# EasyEDA Pro project 16-bit-computer.eprj

# Schematic Schematic1
Create Date: 2024-07-05; Page Name: P1; Project Name: 16-bit-computer; Schematic Name: Schematic1; Update Date: 2024-07-05; Company: EasyEDA.com; Drawn: EasyEDA; Page Size: A4; Part Number: JLCPCB-002; Reviewed: EasyEDA; Version: V0.1
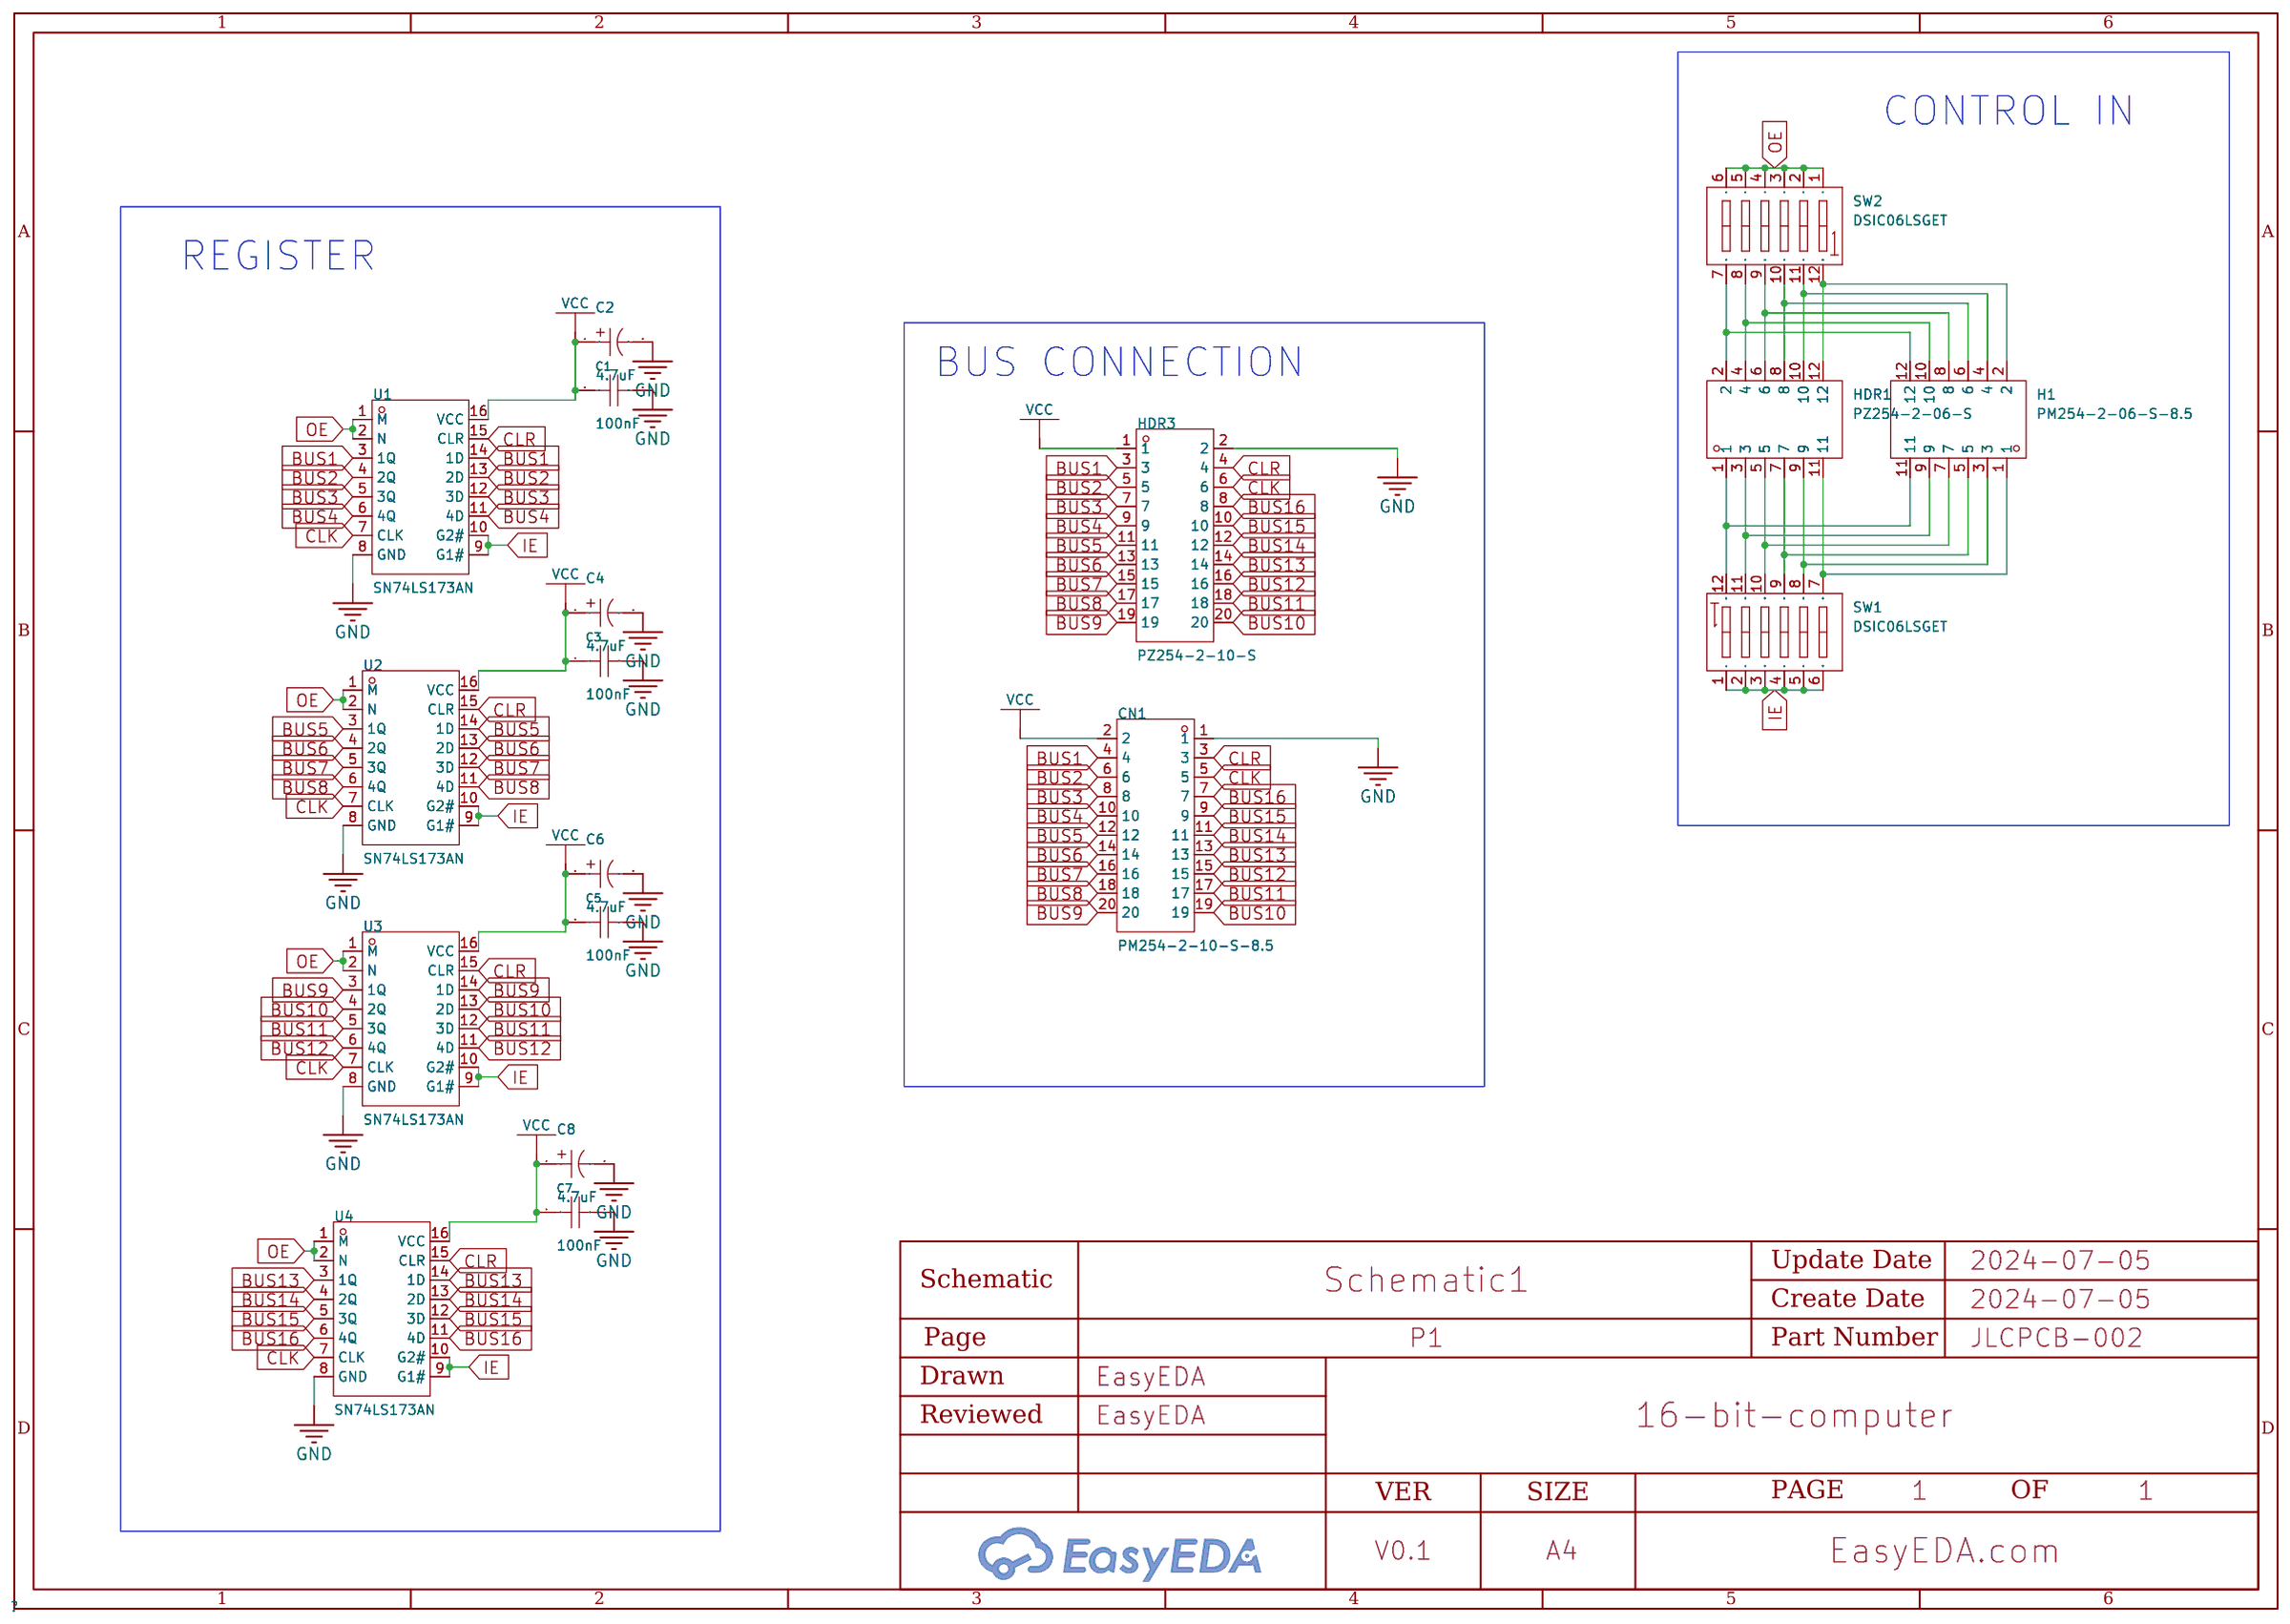
[diagram p0: schematic sheet]

## Parts
C1  100nF  [C0603]
C2  4.7uF  [CAP-SMD_BD4.0-L4.3-W4.3-LS5.0-FD]
C3  100nF  [C0603]
C4  4.7uF  [CAP-SMD_BD4.0-L4.3-W4.3-LS5.0-FD]
C5  100nF  [C0603]
C6  4.7uF  [CAP-SMD_BD4.0-L4.3-W4.3-LS5.0-FD]
C7  100nF  [C0603]
C8  4.7uF  [CAP-SMD_BD4.0-L4.3-W4.3-LS5.0-FD]
CN1  PM254-2-10-S-8.5  [HDR-SMD_20P-P2.54-V-F-R2-C10-S2.54-LS7.1]
H1  PM254-2-06-S-8.5  [HDR-SMD_12P-P2.54-V-F-R2-C6-S7.0]
HDR1  PZ254-2-06-S  [HDR-SMD_12P-P2.54-V-M-R2-C6-S7.4]
HDR3  PZ254-2-10-S  [HDR-SMD_20P-P2.54-V-M-R2-C10-S7.4]
SW1  DSIC06LSGET  [SW-SMD_12P-L15.2-W6.0-P2.54-LS9.3-BL]
SW2  DSIC06LSGET  [SW-SMD_12P-L15.2-W6.0-P2.54-LS9.3-BL]
U1  SN74LS173AN  [PDIP-16_L19.3-W6.4-P2.54-LS7.94-BL]
U2  SN74LS173AN  [PDIP-16_L19.3-W6.4-P2.54-LS7.94-BL]
U3  SN74LS173AN  [PDIP-16_L19.3-W6.4-P2.54-LS7.94-BL]
U4  SN74LS173AN  [PDIP-16_L19.3-W6.4-P2.54-LS7.94-BL]

## Library data of the parts
C1 C3 C5 C7 = CL10B104KB8NNNC: Capacitance: Tolerance:±10% Tolerance:±10% Voltage Rated: Temperature Coefficient:; LCSC Part Name: 100nF ±10% 50V; Supplier Part: C1591; Manufacturer: SAMSUNG(三星); Supplier Footprint: 0603; JLCPCB Part Class: Extended Part; Datasheet: https://atta.szlcsc.com/upload/public/pdf/source/20160218/1457707763339.pdf; Supplier: LCSC; Tolerance: ±10%
C2 C4 C6 C8 = VT4.7UF50V167RV0133: Capacitance: Tolerance:±20% Tolerance:±20% Rated Voltage: Ripple Current:15mA@120Hz Equivalent Series Resistance(ESR):- φD: L: Lifetime @ Temp:2000hrs@105℃ Operating Temperature:-55℃~+105℃ Operating Temperature:-55℃~+105℃; LCSC Part Name: 4.7uF ±20% 50V; Supplier Part: C5246584; Manufacturer: KNSCHA(科尼盛); Supplier Footprint: SMD,D4xL5.4mm; JLCPCB Part Class: Extended Part; Datasheet: https://atta.szlcsc.com/upload/public/pdf/source/20221104/28D100275C90741A69E4DC1F6F9A3749.pdf; Supplier: LCSC; Tolerance: ±20%; Ripple Current: 15mA@120Hz; Lifetime @ Temp: 2000hrs@105℃; Operating Temperature: -55℃~+105℃
CN1 = PM254-2-10-S-8.5: Holes Structure:2x10P Pitch:2.54mm Row Spacing:2.54mm Circular Hole / Square Hole:方孔 Mounting Type:Brick nogging Number of Rows:双排 Number of Holes:20P Current Rating (Max):3A Holes Direction:Top Insulation Height:8.5mm Contact Material:Copper Alloy Operat; LCSC Part Name: 2x10P 间距:2.54mm 立贴; Supplier Part: C3975155; Manufacturer: HCTL(华灿天禄); Supplier Footprint: SMD,P=2.54mm; JLCPCB Part Class: Extended Part; Datasheet: https://atta.szlcsc.com/upload/public/pdf/source/20230609/7C6F8D8E301C6BBC8F19D55951C36597.pdf; Supplier: LCSC; Holes Structure: 2x10P; Pitch: 2.54mm; Row Spacing: 2.54mm; Circular Hole / Square Hole: 方孔; Mounting Type: Brick nogging; Number of Rows: 双排; Number of Holes: 20P; Current Rating (Max): 3A; Holes Direction: Top; Insulation Height: 8.5mm; Contact Material: Copper Alloy; Operating Temperature Range: -40℃~+105℃; Soldering Temperature(Max): 260℃@5S
H1 = PM254-2-06-S-8.5: Holes Structure:2x6P Pitch:2.54mm Row Spacing:2.54mm Circular Hole / Square Hole:方孔 Mounting Type:Brick nogging Number of Rows:双排 Number of Holes:12P Current Rating (Max):3A Holes Direction:Top Insulation Height:8.5mm Contact Material:Copper Alloy Operati; LCSC Part Name: 2x6P 间距:2.54mm 立贴; Supplier Part: C3975151; Manufacturer: HCTL(华灿天禄); Supplier Footprint: SMD,P=2.54mm; JLCPCB Part Class: Extended Part; Datasheet: https://atta.szlcsc.com/upload/public/pdf/source/20230609/7C6F8D8E301C6BBC8F19D55951C36597.pdf; Supplier: LCSC; Holes Structure: 2x6P; Pitch: 2.54mm; Row Spacing: 2.54mm; Circular Hole / Square Hole: 方孔; Mounting Type: Brick nogging; Number of Rows: 双排; Number of Holes: 12P; Current Rating (Max): 3A; Holes Direction: Top; Insulation Height: 8.5mm; Contact Material: Copper Alloy; Operating Temperature Range: -40℃~+105℃; Soldering Temperature(Max): 260℃@5S
HDR1 = PZ254-2-06-S: Pin Structure:2x6P Pitch:2.54mm Row Spacing:2.54mm Circluar Pins/Square Pins:Square Pins Mounting Type:Brick nogging Number of Rows:双排 Number of Pins:12P Current Rating (Max):3A Voltage Rating (Max):250V Length of Mating Pin:6mm Insulation Height:2.5mm Le; LCSC Part Name: 2x6P 间距:2.54mm 方针 立贴 黑色; Supplier Part: C3294464; Manufacturer: HCTL(华灿天禄); Supplier Footprint: SMD,P=2.54mm; JLCPCB Part Class: Extended Part; Datasheet: https://atta.szlcsc.com/upload/public/pdf/source/20230609/FB2B5B924AA338E6CB93C3BD1D012B72.pdf; Supplier: LCSC; Pin Structure: 2x6P; Pitch: 2.54mm; Row Spacing: 2.54mm; Circluar Pins/Square Pins: Square Pins; Mounting Type: Brick nogging; Number of Rows: 双排; Number of Pins: 12P; Current Rating (Max): 3A; Voltage Rating (Max): 250V; Length of Mating Pin: 6mm; Insulation Height: 2.5mm; Operating Temperature Range: -40℃~+105℃; Soldering Temperature(Max): 260℃@5S; Color: Black
HDR3 = PZ254-2-10-S: Pin Structure:2x10P Pitch:2.54mm Row Spacing:2.54mm Circluar Pins/Square Pins:Square Pins Mounting Type:Brick nogging Number of Rows:双排 Number of Pins:20P Current Rating (Max):3A Voltage Rating (Max):250V Length of Mating Pin:6mm Insulation Height:2.5mm L; LCSC Part Name: 2x10P 间距:2.54mm 方针 立贴 黑色; Supplier Part: C3294468; Manufacturer: HCTL(华灿天禄); Supplier Footprint: SMD,P=2.54mm; JLCPCB Part Class: Extended Part; Datasheet: https://atta.szlcsc.com/upload/public/pdf/source/20230609/FB2B5B924AA338E6CB93C3BD1D012B72.pdf; Supplier: LCSC; Pin Structure: 2x10P; Pitch: 2.54mm; Row Spacing: 2.54mm; Circluar Pins/Square Pins: Square Pins; Mounting Type: Brick nogging; Number of Rows: 双排; Number of Pins: 20P; Current Rating (Max): 3A; Voltage Rating (Max): 250V; Length of Mating Pin: 6mm; Insulation Height: 2.5mm; Operating Temperature Range: -40℃~+105℃; Soldering Temperature(Max): 260℃@5S; Color: Black
SW1 SW2 = DSIC06LSGET: Type:平拨,凸起式 Circuit:SPST Number of Positions:6Bit Lead Pitch:2.54mm Operating Life:- Color:Black; LCSC Part Name: 2.54mm 6位高推 拨码开关; Supplier Part: C54952; Manufacturer: YE; Supplier Footprint: SMD-12P,6x15.2mm; JLCPCB Part Class: Extended Part; Datasheet: https://atta.szlcsc.com/upload/public/pdf/source/20150928/1457707425586.pdf; Supplier: LCSC; Type: 平拨,凸起式; Circuit: SPST; Number of Positions: 6Bit; Lead Pitch: 2.54mm; Color: Black
U1-U4 = SN74LS173AN: Type:D-Type Trigger Type:上升沿 Supply Voltage:4.75V~5.25V Supply Voltage:4.75V~5.25V Clock Frequency:50MHz Function:Reset Number of Elements:1 Number of Bits per Element:4 Output Type: Maximum Propagation Delay:30ns@5V,45pF Series:74LSSeries Sink Current:24; Supplier Part: C1550125; Manufacturer: TI(德州仪器); Supplier Footprint: PDIP-16; JLCPCB Part Class: Extended Part; Datasheet: https://www.ti.com/cn/lit/gpn/sn54ls173a; Supplier: LCSC; Type: D-Type; Trigger Type: 上升沿; Supply Voltage: 4.75V~5.25V; Clock Frequency: 50MHz; Function: Reset; Number of Elements: 1; Number of Bits per Element: 4; Maximum Propagation Delay: 30ns@5V,45pF; Series: 74LSSeries; Sink Current: 24mA; Source Current: 2.6mA; Quiescent Current (Iq): 24mA; Operating Temperature: 0℃~+70℃

## Nets
GND: C1.2 C2.2 C3.2 C4.2 C5.2 C6.2 C7.2 C8.2 CN1.1 HDR3.2 U1.8(GND) U2.8(GND) U3.8(GND) U4.8(GND)
VCC: C1.1 C2.1 C3.1 C4.1 C5.1 C6.1 C7.1 C8.1 CN1.2 HDR3.1 U1.16(VCC) U2.16(VCC) U3.16(VCC) U4.16(VCC)
BUS1: CN1.4 HDR3.3 U1.3(1Q) U1.14(1D)
BUS2: CN1.6 HDR3.5 U1.4(2Q) U1.13(2D)
BUS3: CN1.8 HDR3.7 U1.5(3Q) U1.12(3D)
BUS4: CN1.10 HDR3.9 U1.6(4Q) U1.11(4D)
BUS5: CN1.12 HDR3.11 U2.3(1Q) U2.14(1D)
BUS6: CN1.14 HDR3.13 U2.4(2Q) U2.13(2D)
BUS7: CN1.16 HDR3.15 U2.5(3Q) U2.12(3D)
BUS8: CN1.18 HDR3.17 U2.6(4Q) U2.11(4D)
BUS9: CN1.20 HDR3.19 U3.3(1Q) U3.14(1D)
BUS10: CN1.19 HDR3.20 U3.4(2Q) U3.13(2D)
BUS11: CN1.17 HDR3.18 U3.5(3Q) U3.12(3D)
BUS12: CN1.15 HDR3.16 U3.6(4Q) U3.11(4D)
BUS13: CN1.13 HDR3.14 U4.3(1Q) U4.14(1D)
BUS14: CN1.11 HDR3.12 U4.4(2Q) U4.13(2D)
BUS15: CN1.9 HDR3.10 U4.5(3Q) U4.12(3D)
BUS16: CN1.7 HDR3.8 U4.6(4Q) U4.11(4D)
CLK: CN1.5 HDR3.6 U1.7(CLK) U2.7(CLK) U3.7(CLK) U4.7(CLK)
CLR: CN1.3 HDR3.4 U1.15(CLR) U2.15(CLR) U3.15(CLR) U4.15(CLR)
IE: SW1.1(A1) SW1.2(A2) SW1.3(A3) SW1.4(A4) SW1.5(A5) SW1.6(A6) U1.9(G1#) U1.10(G2#) U2.9(G1#) U2.10(G2#) U3.9(G1#) U3.10(G2#) U4.9(G1#) U4.10(G2#)
OE: SW2.1(A1) SW2.2(A2) SW2.3(A3) SW2.4(A4) SW2.5(A5) SW2.6(A6) U1.1(M) U1.2(N) U2.1(M) U2.2(N) U3.1(M) U3.2(N) U4.1(M) U4.2(N)
$1N4246: H1.2 HDR1.12 SW2.12(B1)
$1N4255: H1.4 HDR1.10 SW2.11(B2)
$1N4264: H1.6 HDR1.8 SW2.10(B3)
$1N4273: H1.8 HDR1.6 SW2.9(B4)
$1N4286: H1.10 HDR1.4 SW2.8(B5)
$1N4295: H1.12 HDR1.2 SW2.7(B6)
$1N4304: H1.1 HDR1.11 SW1.7(B6)
$1N4309: H1.3 HDR1.9 SW1.8(B5)
$1N4318: H1.5 HDR1.7 SW1.9(B4)
$1N4327: H1.7 HDR1.5 SW1.10(B3)
$1N4336: H1.9 HDR1.3 SW1.11(B2)
$1N4345: H1.11 HDR1.1 SW1.12(B1)

## Notes on the sheet
- CONTROL IN
- REGISTER
- BUS CONNECTION

# Schematic Schematic2
Create Date: 2024-07-05; Page Name: P1; Project Name: 16-bit-computer; Schematic Name: Schematic2; Update Date: 2024-07-05; Company: EasyEDA.com; Drawn: EasyEDA; Page Size: A4; Part Number: JLCPCB-002; Reviewed: EasyEDA; Version: V0.1
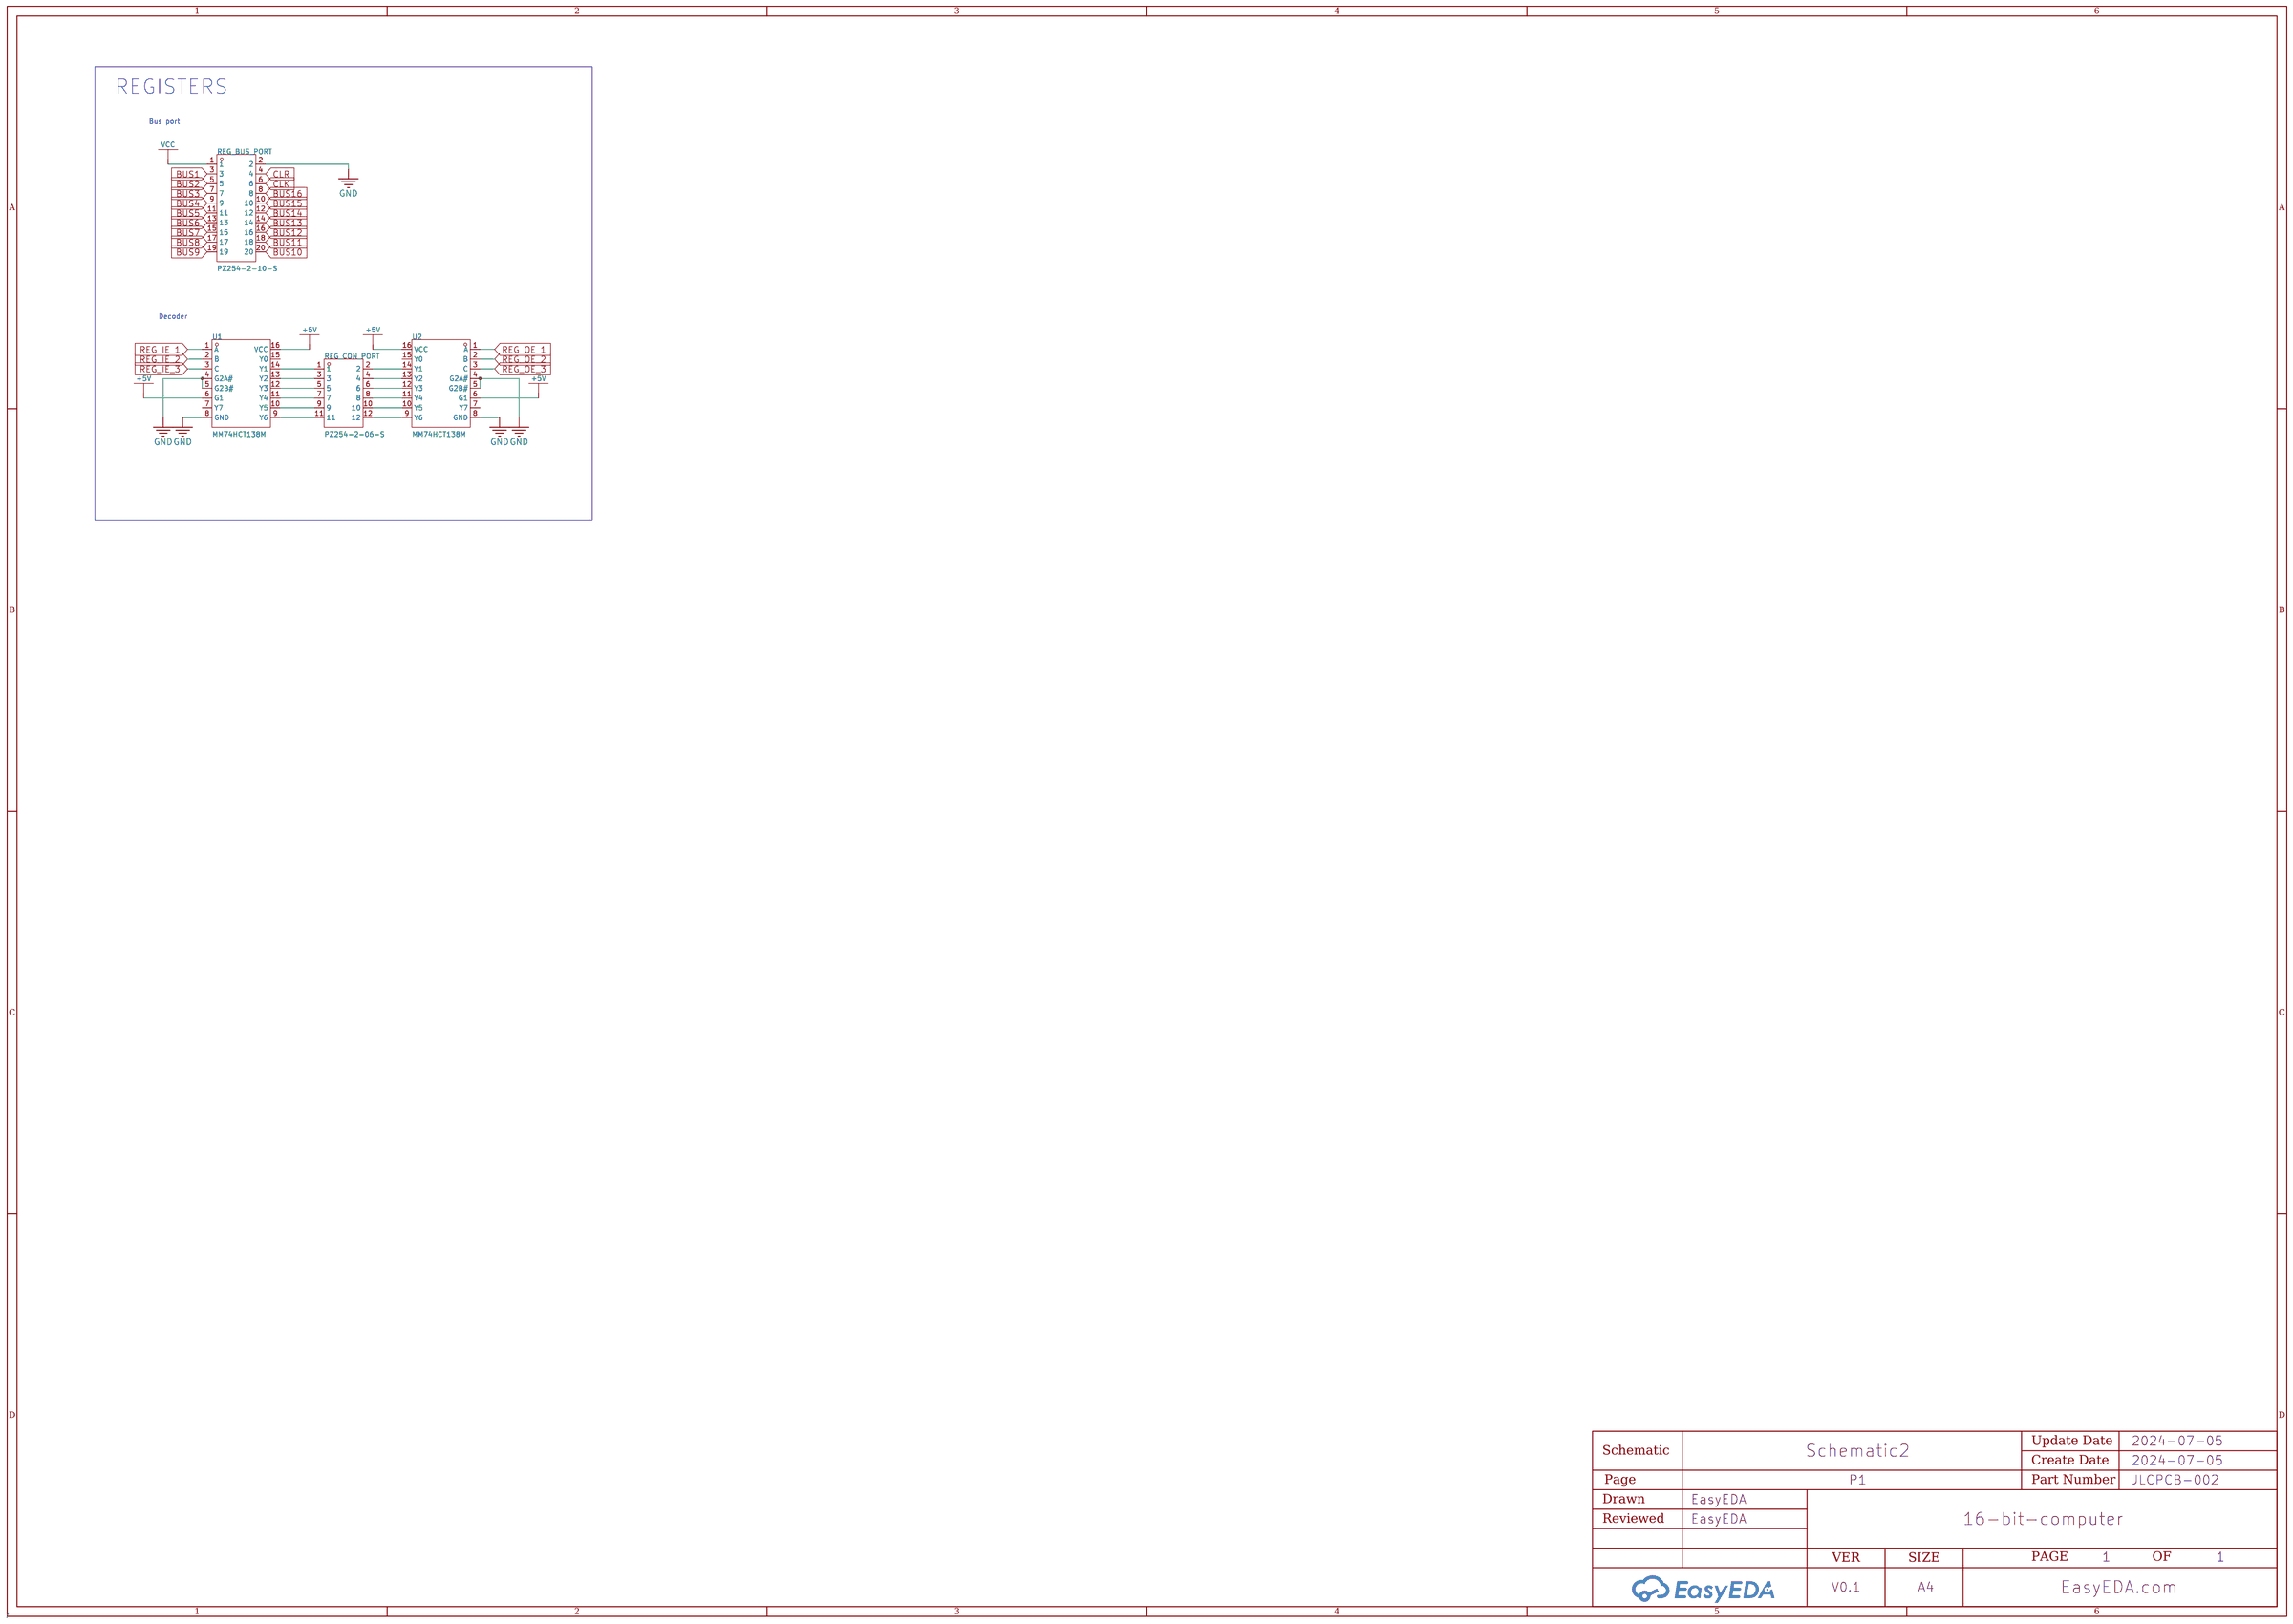
[diagram p1: schematic sheet]

## Parts
REG_BUS_PORT  PZ254-2-10-S  [HDR-SMD_20P-P2.54-V-M-R2-C10-S7.4]
REG_CON_PORT  PZ254-2-06-S  [HDR-SMD_12P-P2.54-V-M-R2-C6-S7.4]
U1  MM74HCT138M  [SOIC-16_L9.9-W3.9-P1.27-LS6.0-BL]
U2  MM74HCT138M  [SOIC-16_L9.9-W3.9-P1.27-LS6.0-BL]

## Library data of the parts
REG_BUS_PORT = PZ254-2-10-S: Pin Structure:2x10P Pitch:2.54mm Row Spacing:2.54mm Circluar Pins/Square Pins:Square Pins Mounting Type:Brick nogging Number of Rows:双排 Number of Pins:20P Current Rating (Max):3A Voltage Rating (Max):250V Length of Mating Pin:6mm Insulation Height:2.5mm L; LCSC Part Name: 2x10P 间距:2.54mm 方针 立贴 黑色; Supplier Part: C3294468; Manufacturer: HCTL(华灿天禄); Supplier Footprint: SMD,P=2.54mm; JLCPCB Part Class: Extended Part; Datasheet: https://atta.szlcsc.com/upload/public/pdf/source/20230609/FB2B5B924AA338E6CB93C3BD1D012B72.pdf; Supplier: LCSC; Pin Structure: 2x10P; Pitch: 2.54mm; Row Spacing: 2.54mm; Circluar Pins/Square Pins: Square Pins; Mounting Type: Brick nogging; Number of Rows: 双排; Number of Pins: 20P; Current Rating (Max): 3A; Voltage Rating (Max): 250V; Length of Mating Pin: 6mm; Insulation Height: 2.5mm; Operating Temperature Range: -40℃~+105℃; Soldering Temperature(Max): 260℃@5S; Color: Black
REG_CON_PORT = PZ254-2-06-S: Pin Structure:2x6P Pitch:2.54mm Row Spacing:2.54mm Circluar Pins/Square Pins:Square Pins Mounting Type:Brick nogging Number of Rows:双排 Number of Pins:12P Current Rating (Max):3A Voltage Rating (Max):250V Length of Mating Pin:6mm Insulation Height:2.5mm Le; LCSC Part Name: 2x6P 间距:2.54mm 方针 立贴 黑色; Supplier Part: C3294464; Manufacturer: HCTL(华灿天禄); Supplier Footprint: SMD,P=2.54mm; JLCPCB Part Class: Extended Part; Datasheet: https://atta.szlcsc.com/upload/public/pdf/source/20230609/FB2B5B924AA338E6CB93C3BD1D012B72.pdf; Supplier: LCSC; Pin Structure: 2x6P; Pitch: 2.54mm; Row Spacing: 2.54mm; Circluar Pins/Square Pins: Square Pins; Mounting Type: Brick nogging; Number of Rows: 双排; Number of Pins: 12P; Current Rating (Max): 3A; Voltage Rating (Max): 250V; Length of Mating Pin: 6mm; Insulation Height: 2.5mm; Operating Temperature Range: -40℃~+105℃; Soldering Temperature(Max): 260℃@5S; Color: Black
U1 U2 = MM74HCT138M: Type:Decoder/Demultiplexers Voltage Supply Source:Single supply Supply Voltage:4.5V~5.5V Supply Voltage:4.5V~5.5V Sink Current:4.8mA Source Current:4.8mA Operating temperature:-40℃~+85℃ Operating temperature:-40℃~+85℃; Supplier Part: C906893; Manufacturer: onsemi(安森美); Supplier Footprint: SOIC-16; JLCPCB Part Class: Extended Part; Datasheet: https://atta.szlcsc.com/upload/public/pdf/source/20210720/C906893_1BC560CB53C63A6B39486B89408AFB3E.pdf; Supplier: LCSC; Type: Decoder/Demultiplexers; Voltage Supply Source: Single supply; Supply Voltage: 4.5V~5.5V; Sink Current: 4.8mA; Source Current: 4.8mA; Operating temperature: -40℃~+85℃

## Nets
+5V: U1.6(G1) U1.16(VCC) U2.6(G1) U2.16(VCC)
GND: REG_BUS_PORT.2 U1.4(G2A#) U1.5(G2B#) U1.8(GND) U2.4(G2A#) U2.5(G2B#) U2.8(GND)
VCC: REG_BUS_PORT.1
BUS1: REG_BUS_PORT.3
BUS2: REG_BUS_PORT.5
BUS3: REG_BUS_PORT.7
BUS4: REG_BUS_PORT.9
BUS5: REG_BUS_PORT.11
BUS6: REG_BUS_PORT.13
BUS7: REG_BUS_PORT.15
BUS8: REG_BUS_PORT.17
BUS9: REG_BUS_PORT.19
BUS10: REG_BUS_PORT.20
BUS11: REG_BUS_PORT.18
BUS12: REG_BUS_PORT.16
BUS13: REG_BUS_PORT.14
BUS14: REG_BUS_PORT.12
BUS15: REG_BUS_PORT.10
BUS16: REG_BUS_PORT.8
CLK: REG_BUS_PORT.6
CLR: REG_BUS_PORT.4
REG_IE_1: U1.1(A)
REG_IE_2: U1.2(B)
REG_IE_3: U1.3(C)
REG_OE_1: U2.1(A)
REG_OE_2: U2.2(B)
REG_OE_3: U2.3(C)
Net-(REG_CON_PORT-1): REG_CON_PORT.1 U1.14(Y1)
Net-(REG_CON_PORT-2): REG_CON_PORT.2 U2.14(Y1)
Net-(REG_CON_PORT-3): REG_CON_PORT.3 U1.13(Y2)
Net-(REG_CON_PORT-4): REG_CON_PORT.4 U2.13(Y2)
Net-(REG_CON_PORT-5): REG_CON_PORT.5 U1.12(Y3)
Net-(REG_CON_PORT-6): REG_CON_PORT.6 U2.12(Y3)
Net-(REG_CON_PORT-7): REG_CON_PORT.7 U1.11(Y4)
Net-(REG_CON_PORT-8): REG_CON_PORT.8 U2.11(Y4)
Net-(REG_CON_PORT-9): REG_CON_PORT.9 U1.10(Y5)
Net-(REG_CON_PORT-10): REG_CON_PORT.10 U2.10(Y5)
Net-(REG_CON_PORT-11): REG_CON_PORT.11 U1.9(Y6)
Net-(REG_CON_PORT-12): REG_CON_PORT.12 U2.9(Y6)

Not connected (* = marked no-connect by the designer): U1 7(Y7) 15(Y0); U2 7(Y7) 15(Y0)

## Notes on the sheet
- REGISTERS
- Bus port
- Decoder

# Board PCB1
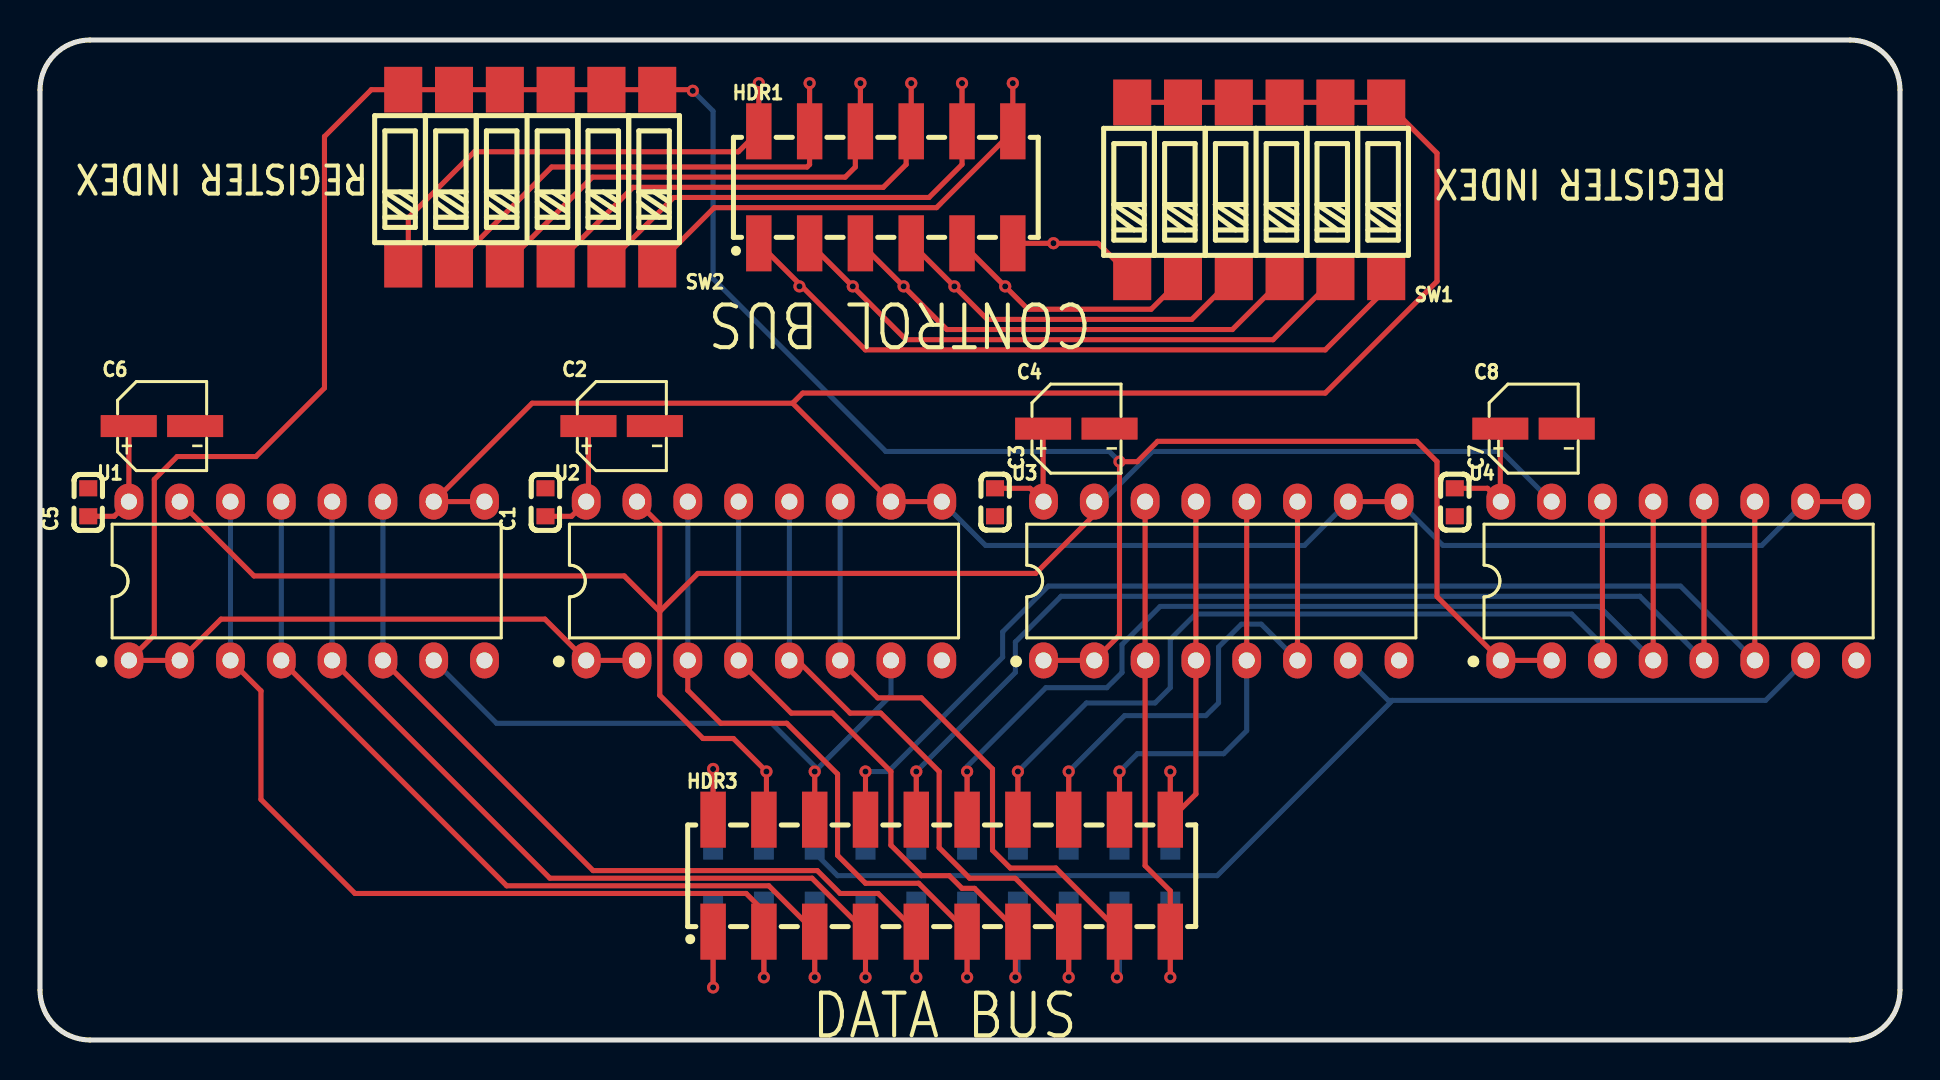
[diagram p2: board, top side]
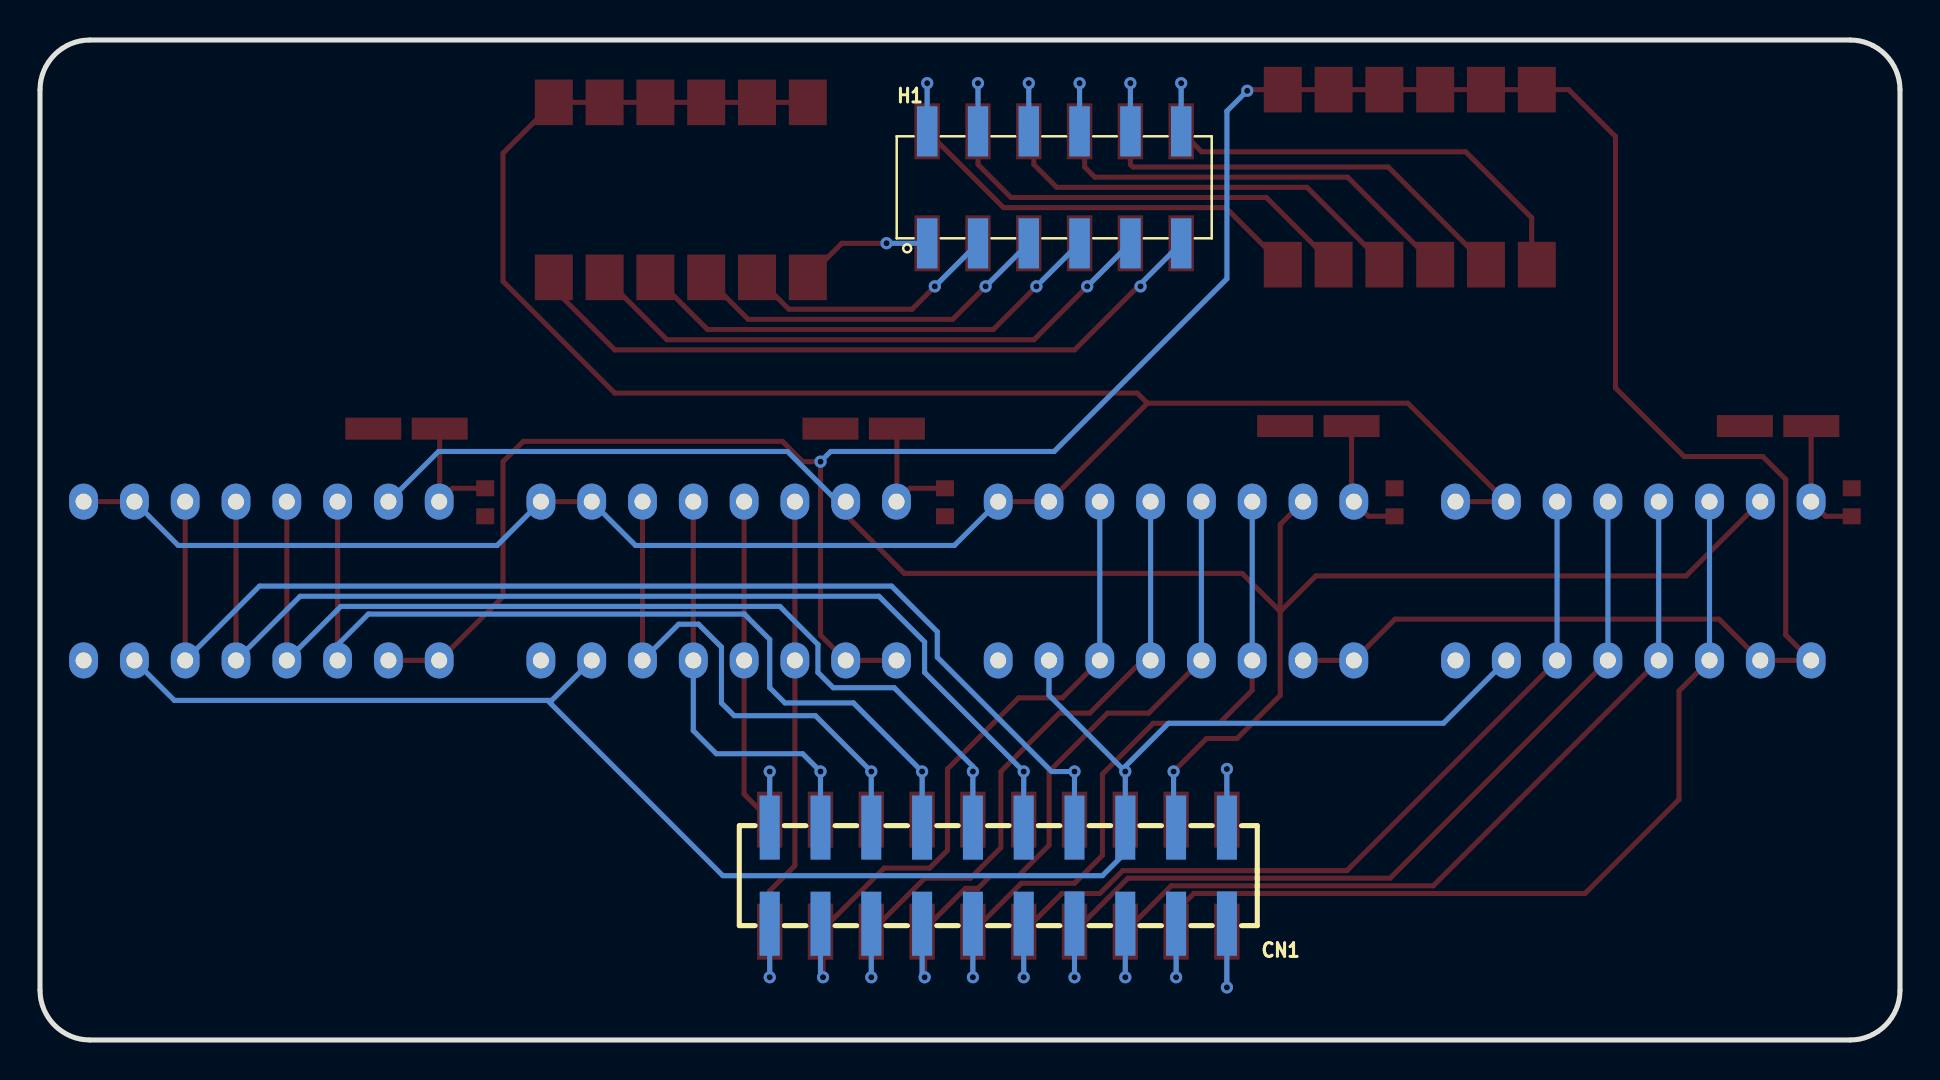
[diagram p3: board, bottom side, seen from below]

Outline 93 x 50 mm; copper layers: Top Layer, Bottom Layer. Coordinates in mm from the lower left corner of the outline.
Outline path: 0,47.5 0,2.5 arc(0.73,0.73) 2.5,0 90.5,0 arc(92.27,0.73) 93,2.5 93,47.5 arc(92.27,49.27) 90.5,50 2.5,50 arc(0.73,49.27) 0,47.5
Stack: Top Layer 0.035mm / Dielectric1 1.51mm FR4 er 4.5 / Bottom Layer 0.035mm

## Design rules (mm)
template: JLCPCB Capability(Two Layers Board)
spacing copperThickness1oz (default): track to track 0.102, other pairs 0.152 to 0.3
spacing copperThickness2oz: track to track 0.203, other pairs 0.152 to 0.3
track width copperThickness1oz (default): min 0.127, default 0.254, max 2.54
track width copperThickness2oz: min 0.203, default 0.254, max 2.54
differential pair differentialPair (default): width min 0.127, default 0.254, max 2.54; gap min 0.152, default 0.152
via viaSize (default): diameter min 0.5, default 0.61, max 10; hole min 0.3, default 0.305, max 6.3

## Placement (name value [footprint] x y rotation side)
C1  100nF  [C0603]  25.27 26.89 90 top
C2  4.7uF  [CAP-SMD_BD4.0-L4.3-W4.3-LS5.0-FD]  29.08 30.7 0 top
C3  100nF  [C0603]  47.75 26.89 270 top
C4  4.7uF  [CAP-SMD_BD4.0-L4.3-W4.3-LS5.0-FD]  51.82 30.57 0 top
C5  100nF  [C0603]  2.41 26.89 90 top
C6  4.7uF  [CAP-SMD_BD4.0-L4.3-W4.3-LS5.0-FD]  6.1 30.7 0 top
C7  100nF  [C0603]  70.74 26.89 270 top
C8  4.7uF  [CAP-SMD_BD4.0-L4.3-W4.3-LS5.0-FD]  74.68 30.57 0 top
CN1  PM254-2-10-S-8.5  [HDR-SMD_20P-P2.54-V-F-R2-C10-S2.54-LS7.1]  45.09 8.22 0 bottom
H1  PM254-2-06-S-8.5  [HDR-SMD_12P-P2.54-V-F-R2-C6-S7.0]  42.29 42.63 180 bottom
HDR1  PZ254-2-06-S  [HDR-SMD_12P-P2.54-V-M-R2-C6-S7.4]  42.29 42.63 0 top
HDR3  PZ254-2-10-S  [HDR-SMD_20P-P2.54-V-M-R2-C10-S7.4]  45.09 8.22 0 top
SW1  DSIC06LSGET  [SW-SMD_12P-L15.2-W6.0-P2.54-LS9.3-BL]  60.96 42.51 180 top
SW2  DSIC06LSGET  [SW-SMD_12P-L15.2-W6.0-P2.54-LS9.3-BL]  24.51 43.14 180 top
U1  SN74LS173AN  [PDIP-16_L19.3-W6.4-P2.54-LS7.94-BL]  13.33 22.95 0 top
U2  SN74LS173AN  [PDIP-16_L19.3-W6.4-P2.54-LS7.94-BL]  36.2 22.95 0 top
U3  SN74LS173AN  [PDIP-16_L19.3-W6.4-P2.54-LS7.94-BL]  59.06 22.95 0 top
U4  SN74LS173AN  [PDIP-16_L19.3-W6.4-P2.54-LS7.94-BL]  81.93 22.95 0 top

## Footprints (pads in the part's own frame, mm; a bottom-side part is the same pattern mirrored in y, then rotated)
C0603
  rect 0.8x0.9 smd: 1(-0.7,0) 2(0.7,0)
CAP-SMD_BD4.0-L4.3-W4.3-LS5.0-FD
  rect 2.8x1.1 smd: 1(-1.661,0) 2(1.661,0)
HDR-SMD_12P-P2.54-V-F-R2-C6-S7.0
  rect 1.02x2.5 smd: 1(-6.35,-2.8) 2(-6.35,2.8) 3(-3.81,-2.8) 4(-3.81,2.8) 5(-1.27,-2.8) 6(-1.27,2.8) 7(1.27,-2.8) 8(1.27,2.8) 9(3.81,-2.8) 10(3.81,2.8) 11(6.35,-2.8) 12(6.35,2.8)
HDR-SMD_12P-P2.54-V-M-R2-C6-S7.4
  rect 1.27x2.8 smd: 1(-6.35,-2.8) 2(-6.35,2.8) 3(-3.81,-2.8) 4(-3.81,2.8) 5(-1.27,-2.8) 6(-1.27,2.8) 7(1.27,-2.8) 8(1.27,2.8) 9(3.81,-2.8) 10(3.81,2.8) 11(6.35,-2.8) 12(6.35,2.8)
HDR-SMD_20P-P2.54-V-F-R2-C10-S2.54-LS7.1
  rect 1x3.2 smd: 1(-11.43,-2.4) 2(-11.43,2.4) 3(-8.89,-2.4) 4(-8.89,2.4) 5(-6.35,-2.4) 6(-6.35,2.4) 7(-3.81,-2.4) 8(-3.81,2.4) 9(-1.27,-2.4) 10(-1.27,2.4) 11(1.27,-2.4) 12(1.27,2.4) 13(3.81,-2.4) 14(3.81,2.4) 15(6.35,-2.4) 16(6.35,2.4) 17(8.89,-2.4) 18(8.89,2.4) 19(11.43,-2.4) 20(11.43,2.4)
HDR-SMD_20P-P2.54-V-M-R2-C10-S7.4
  rect 1.27x2.8 smd: 1(-11.43,-2.8) 2(-11.43,2.8) 3(-8.89,-2.8) 4(-8.89,2.8) 5(-6.35,-2.8) 6(-6.35,2.8) 7(-3.81,-2.8) 8(-3.81,2.8) 9(-1.27,-2.8) 10(-1.27,2.8) 11(1.27,-2.8) 12(1.27,2.8) 13(3.81,-2.8) 14(3.81,2.8) 15(6.35,-2.8) 16(6.35,2.8) 17(8.89,-2.8) 18(8.89,2.8) 19(11.43,-2.8) 20(11.43,2.8)
PDIP-16_L19.3-W6.4-P2.54-LS7.94-BL
  oval 1.44x1.8 hole 0.8: 1(-8.89,-3.97) 2(-6.35,-3.97) 3(-3.81,-3.97) 4(-1.27,-3.97) 5(1.27,-3.97) 6(3.81,-3.97) 7(6.35,-3.97) 8(8.89,-3.97) 9(8.89,3.97) 10(6.35,3.97) 11(3.81,3.97) 12(1.27,3.97) 13(-1.27,3.97) 14(-3.81,3.97) 15(-6.35,3.97) 16(-8.89,3.97)
SW-SMD_12P-L15.2-W6.0-P2.54-LS9.3-BL
  rect 1.9x2.28 smd: 1(-6.35,-4.375) 2(-3.81,-4.375) 3(-1.27,-4.375) 4(1.27,-4.375) 5(3.81,-4.375) 6(6.35,-4.375) 7(6.35,4.375) 8(3.81,4.375) 9(1.27,4.375) 10(-1.27,4.375) 11(-3.81,4.375) 12(-6.35,4.375)

## Nets
As in the schematic.

## Via types
v1: diameter 0.61, hole 0.305, Top Layer to Bottom Layer, 34 vias

## Routing (per net, layer and track width the routed paths; a pad name or vN(x,y) marks a point on that pad's centre or on a via; arc(x,y) is an arc through that point)
GND: length 5.5
  Top Layer w0.254: v1(33.66,13.55) HDR3.2
  Bottom Layer w0.254: v1(33.66,13.55) CN1.1
VCC: length 30.7
  Top Layer w0.254: C2.1 27.42,27.03 U2.16 26.58,26.19 C1.1 ; C3.1 49.51,27.59 50.16,26.94 ; 73.02,26.94 72.37,27.59 C7.1 ; 73.02,26.94 73.04,26.92 ; 73.02,26.94 C8.1 ; HDR3.1 33.66,2.76 ; C6.1 4.44,30.69 U1.16 3.71,26.19 C5.1 ; C4.1 50.16,26.94 ; 50.16,26.94 U3.16
  Bottom Layer w0.254: CN1.2 v1(33.66,2.63)
BUS1: length 49
  Top Layer w0.254: v1(36.19,3.14) HDR3.3 36.19,6.44 35.31,7.33 15.75,7.33 11.05,12.03 11.05,17.45 U1.3
  Bottom Layer w0.254: v1(36.19,3.14) CN1.4 ; U1.14 U1.3
BUS2: length 45.2
  Top Layer w0.254: U1.4 23.33,7.71 36.44,7.71 HDR3.5 v1(38.73,3.14)
  Bottom Layer w0.254: v1(38.73,3.14) CN1.6 ; U1.13 U1.4
BUS3: length 45.2
  Top Layer w0.254: U1.5 25.49,8.09 38.6,8.09 HDR3.7 v1(41.28,3.14)
  Bottom Layer w0.254: v1(41.28,3.14) CN1.8 ; U1.12 U1.5
BUS4: length 45.2
  Top Layer w0.254: v1(43.81,3.14) HDR3.9 41.9,7.33 40,7.33 38.86,8.47 27.65,8.47 U1.6
  Bottom Layer w0.254: U1.11 U1.6 ; v1(43.81,3.14) CN1.10
BUS5: length 35.7
  Top Layer w0.254: U2.3 32.39,17.48 34.04,15.84 37.34,15.84 39.88,13.3 39.88,9.23 41.28,7.84 43.94,7.84 HDR3.11 v1(46.35,3.14)
  Bottom Layer w0.254: v1(46.35,3.14) CN1.12 ; U2.14 U2.3
BUS6: length 34.7
  Top Layer w0.254: v1(48.77,3.14) 48.77,5.29 HDR3.13 46.73,7.58 46.1,7.58 45.47,8.22 44.07,8.22 42.54,9.74 42.54,13.42 39.62,16.34 37.56,16.34 34.93,18.98
  Bottom Layer w0.254: v1(48.77,3.14) 48.9,3.26 CN1.14 ; 34.93,26.92 34.93,18.98
BUS7: length 34.7
  Top Layer w0.254: U2.5 37.87,18.98 40.51,16.34 42.04,16.34 44.96,13.42 44.96,9.61 46.48,8.09 48.76,8.09 HDR3.15 v1(51.44,3.14)
  Bottom Layer w0.254: v1(51.44,3.14) CN1.16 ; U2.12 U2.5
BUS8: length 35
  Top Layer w0.254: v1(53.85,3.14) 53.85,5.29 HDR3.17 50.79,8.6 48.51,8.6 47.62,9.49 47.62,13.55 44.07,17.11 41.88,17.11 U2.6
  Bottom Layer w0.254: U2.11 U2.6 ; v1(53.85,3.14) 53.97,3.26 CN1.18
BUS9: length 27
  Top Layer w0.254: U3.14 U3.3 55.25,8.71 56.51,7.45 HDR3.19 v1(56.51,3.14)
  Bottom Layer w0.254: v1(56.51,3.14) CN1.20
BUS10: length 21.6
  Top Layer w0.254: v1(56.51,13.42) HDR3.20 57.79,12.3 U3.4 U3.13
  Bottom Layer w0.254: v1(56.51,13.42) CN1.19
BUS11: length 23.9
  Top Layer w0.254: HDR3.18 v1(53.97,13.42) ; U3.12 U3.5
  Bottom Layer w0.254: U3.5 60.34,15.47 59.18,14.31 54.86,14.31 v1(53.97,13.42) CN1.17
BUS12: length 30
  Top Layer w0.254: U3.11 U3.6 ; HDR3.16 v1(51.44,13.42)
  Bottom Layer w0.254: CN1.15 v1(51.44,13.42) 54.23,16.22 58.29,16.22 58.93,16.85 58.93,19.65 60.07,20.79 61.06,20.79 U3.6
BUS13: length 48.5
  Top Layer w0.254: HDR3.14 v1(48.9,13.42) ; U4.14 U4.3
  Bottom Layer w0.254: U4.3 78.12,19.76 76.58,21.3 57.78,21.3 56.51,20.03 56.51,17.61 55.75,16.85 52.32,16.85 v1(48.9,13.42) CN1.13
BUS14: length 53
  Top Layer w0.254: U4.13 U4.4 ; v1(46.35,13.42) HDR3.12
  Bottom Layer w0.254: U4.4 77.96,21.68 56.01,21.68 54.1,19.77 54.1,18.38 53.34,17.61 50.29,17.61 46.35,13.68 v1(46.35,13.42) CN1.11
BUS15: length 58.4
  Top Layer w0.254: 83.2,26.92 83.2,18.98 ; HDR3.10 v1(43.81,13.42)
  Bottom Layer w0.254: CN1.9 v1(43.81,13.42) 48.77,18.38 48.77,19.9 51.05,22.19 79.99,22.19 83.2,18.98
BUS16: length 63.7
  Top Layer w0.254: U4.11 U4.6 ; v1(41.28,13.42) HDR3.8
  Bottom Layer w0.254: U4.6 82.02,22.69 50.42,22.69 48.13,20.41 48.13,19.14 42.42,13.42 v1(41.28,13.42) CN1.7
CLK: length 92.6
  Top Layer w0.254: v1(38.73,13.42) HDR3.6
  Bottom Layer w0.254: U3.7 67.41,16.98 67.62,16.98 ; 67.62,16.98 86.28,16.98 U4.7 ; 67.62,16.98 58.86,8.22 39.88,8.22 38.73,9.36 CN1.5 v1(38.73,13.42) ; v1(38.73,13.42) 42.55,17.24 42.55,18.98 ; v1(38.73,13.42) 38.73,13.68 36.58,15.84 22.83,15.84 U1.7
CLR: length 98
  Top Layer w0.254: U3.15 52.72,26.26 49.78,23.33 32.89,23.33 30.99,21.42 ; U2.15 30.99,25.78 30.99,21.42 ; 30.99,21.42 29.21,23.2 10.7,23.2 U1.15 ; 30.99,21.42 30.99,17.23 33.15,15.07 34.67,15.07 v1(36.32,13.42) 36.32,11.14 HDR3.4
  Bottom Layer w0.254: v1(36.32,13.42) 36.32,10.74 CN1.3 ; U4.15 73.07,29.43 55.63,29.43 53.12,26.92 U3.15
IE: length 138.8
  Top Layer w0.254: 37.63,31.84 24.6,31.84 U1.10 U1.9 ; 37.63,31.84 42.55,26.92 45.09,26.92 ; 37.63,31.84 38.14,32.35 64.26,32.35 69.85,37.93 69.85,44.34 SW1.1 SW1.2 SW1.3 SW1.4 SW1.5 SW1.6 ; U3.9 U3.10 ; U4.9 U4.10
  Bottom Layer w0.254: U3.9 70.15,24.73 86.09,24.73 U4.10 ; U3.10 63.22,24.73 47.28,24.73 45.09,26.92
OE: length 156.5
  Top Layer w0.254: v1(32.64,47.46) 32.58,47.52 SW2.1 SW2.2 SW2.3 SW2.4 SW2.5 SW2.6 16.57,47.52 14.22,45.17 14.22,32.6 10.8,29.17 6.86,29.17 5.72,28.03 5.72,20.25 U1.1 U1.2 9.05,21.04 25.25,21.04 U2.1 U2.2 ; U4.2 73.04,18.98 69.85,22.17 69.85,28.92 68.83,29.93 55.88,29.93 54.86,28.92 v1(53.97,28.92) 53.97,20.24 U3.2 U3.1
  Bottom Layer w0.254: v1(32.64,47.46) 33.66,46.44 33.66,38.06 42.29,29.43 53.47,29.43 v1(53.97,28.92)
$1N4246: length 25.4
  Top Layer w0.254: SW2.12 33.71,41.62 44.82,41.62 HDR1.12 v1(48.64,47.84)
  Bottom Layer w0.254: v1(48.64,47.84) HDR1.12
$1N4255: length 26.3
  Top Layer w0.254: v1(46.1,47.84) HDR1.10 46.1,43.78 44.45,42.13 31.68,42.13 SW2.11
  Bottom Layer w0.254: v1(46.1,47.84) HDR1.10
$1N4264: length 26.4
  Top Layer w0.254: SW2.10 29.65,42.63 42.16,42.63 43.31,43.78 43.31,45.18 HDR1.8 v1(43.56,47.84)
  Bottom Layer w0.254: 43.43,47.71 v1(43.56,47.84) HDR1.8
$1N4273: length 26.3
  Top Layer w0.254: SW2.9 27.62,43.14 40.26,43.14 40.77,43.65 40.77,45.18 HDR1.6 v1(41.02,47.84)
  Bottom Layer w0.254: v1(41.02,47.84) HDR1.6
$1N4286: length 26.3
  Top Layer w0.254: v1(38.48,47.84) HDR1.4 38.48,43.78 38.35,43.65 25.58,43.65 SW2.8
  Bottom Layer w0.254: v1(38.48,47.84) HDR1.4
$1N4295: length 26.8
  Top Layer w0.254: SW2.7 18.41,39.02 18.41,41.11 21.72,44.41 34.92,44.41 HDR1.2 v1(35.94,47.84)
  Bottom Layer w0.254: HDR1.2 v1(35.94,47.84) 36.07,47.97
$1N4304: length 8.7
  Top Layer w0.254: HDR1.11 52.91,39.83 SW1.7
  Bottom Layer w0.254: v1(50.67,39.84) 50.67,39.83 HDR1.11
$1N4309: length 16.1
  Top Layer w0.254: HDR1.9 49.4,36.54 55.56,36.54 SW1.8
  Bottom Layer w0.254: v1(48.26,37.68) 48.25,37.68 HDR1.9
$1N4318: length 21.6
  Top Layer w0.254: HDR1.7 47.37,36.03 57.59,36.03 SW1.9
  Bottom Layer w0.254: v1(45.72,37.68) 45.71,37.68 HDR1.7
$1N4327: length 26.8
  Top Layer w0.254: HDR1.5 41.03,39.83 v1(43.18,37.68) 45.34,35.52 59.62,35.52 SW1.10
  Bottom Layer w0.254: 42.93,37.93 41.03,39.83 HDR1.5
$1N4336: length 32.6
  Top Layer w0.254: HDR1.3 43.3,35.01 61.65,35.01 SW1.11
  Bottom Layer w0.254: HDR1.3 38.49,39.83 v1(40.64,37.68)
$1N4345: length 38.4
  Top Layer w0.254: HDR1.1 41.27,34.51 64.26,34.51 67.31,37.55 SW1.12
  Bottom Layer w0.254: HDR1.1 37.97,37.8 v1(37.97,37.68)

## Copper pours and planes (outline as drawn; the poured copper is in the pictures)
GND on Top Layer: -2.92,52.67 97.03,52.67 97.03,-3.21 -2.92,-3.21
VCC on Bottom Layer: -11.05,56.1 103.12,56.1 103.12,-7.28 -11.05,-7.28

## Text on the board
Top Silkscreen Layer: REGISTER INDEX | DATA BUS | CONTROL BUS
